# EAGLE design Arduino Micro RGB Controller (EAGLE 8.6.0)
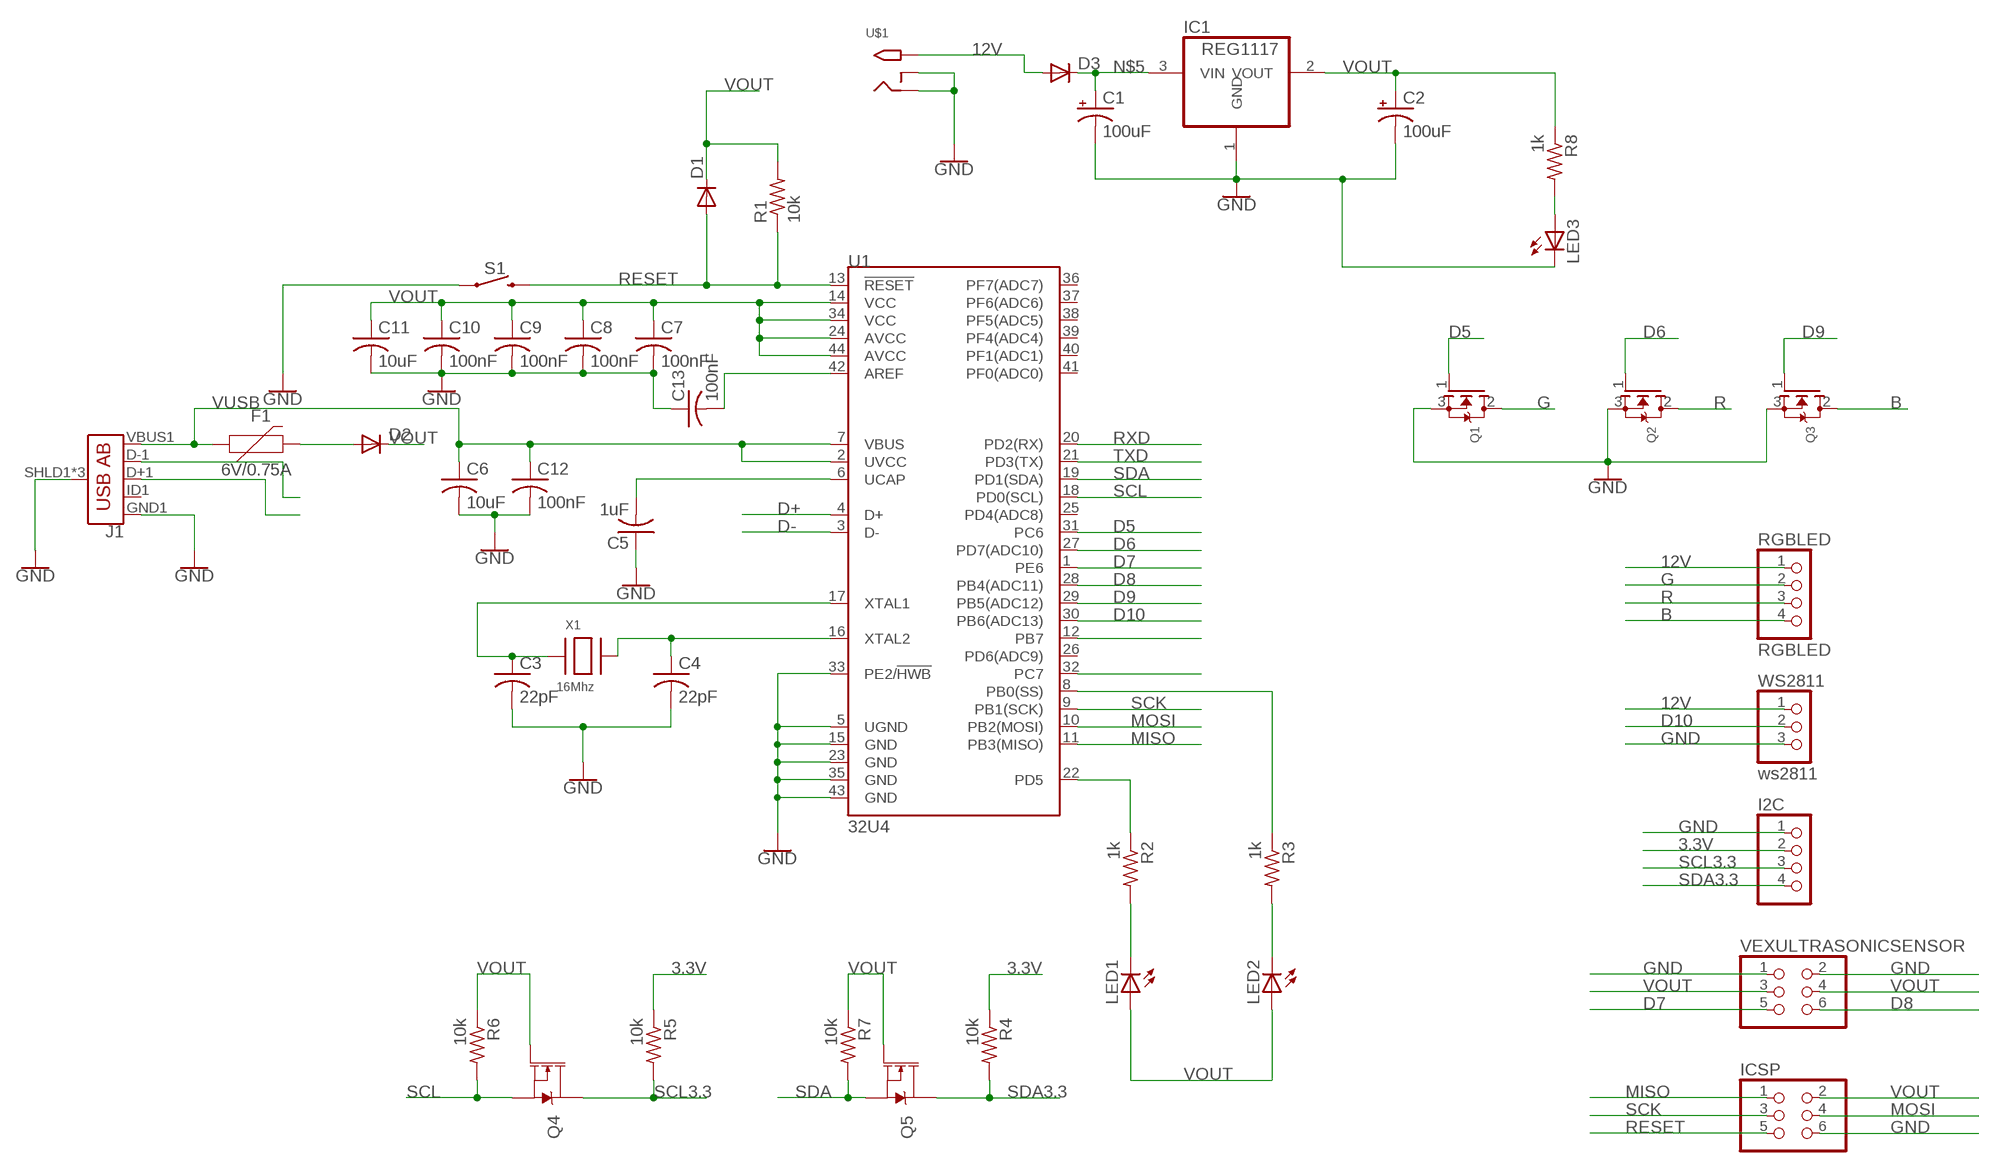
[diagram p0: schematic, sheet 1]

## Parts
C1  100uF  CPOL-USCT7343  [CT7343]
C2  100uF  CPOL-USCT7343  [CT7343]
C3  22pF  C-USC0805  [C0805]
C4  22pF  C-USC0805  [C0805]
C5  1uF  C-USC0805  [C0805]
C6  10uF  C-USC0805  [C0805]
C7  100nF  C-USC0805  [C0805]
C8  100nF  C-USC0805  [C0805]
C9  100nF  C-USC0805  [C0805]
C10  100nF  C-USC0805  [C0805]
C11  10uF  C-USC0805  [C0805]
C12  100nF  C-USC0805  [C0805]
C13  100nF  C-USC0805  [C0805]
D1  DIODE-SOD123  [SOD123]
D2  DIODE-SOD123  [SOD123]
D3  DIODE-SOD123  [SOD123]
F1  6V/0.75A  PPTC_THREE-QUARTER-AMP  [1206]
I2C  PINHD-1X4  [1X04]
IC1  REG1117  [SOT223]
ICSP  PINHD-2X3  [2X03]
J1  USB_AB_SMT  [USB-AB-MICRO-SMD]
LED1  LEDCHIPLED_0603  [CHIPLED_0603]
LED2  LEDCHIPLED_0603  [CHIPLED_0603]
LED3  LEDCHIPLED_0603  [CHIPLED_0603]
Q1  MOSFET-NGDS_TO220V  [TO220V]
Q2  MOSFET-NGDS_TO220V  [TO220V]
Q3  MOSFET-NGDS_TO220V  [TO220V]
Q4  220mA/50V/3.5Ω  MOSFET-NCH-BSS138  [SOT23-3]
Q5  220mA/50V/3.5Ω  MOSFET-NCH-BSS138  [SOT23-3]
R1  10k  R-US_M0805  [M0805]
R2  1k  R-US_M0805  [M0805]
R3  1k  R-US_M0805  [M0805]
R4  10k  R-US_M0805  [M0805]
R5  10k  R-US_M0805  [M0805]
R6  10k  R-US_M0805  [M0805]
R7  10k  R-US_M0805  [M0805]
R8  1k  R-US_M0805  [M0805]
RGBLED  RGBLED  PINHD-1X4  [1X04]
S1  MOMENTARY-SWITCH-SPST-SMD-6.0X3.5MM  [TACTILE_SWITCH_SMD_6.0X3.5MM]
U1  32U4  ATMEGA32U4TQFP-44  [TQFP44]
U$1  2.1MMJACKTHM  [PJ-102A]
VEXULTRASONICSENSOR  PINHD-2X3  [2X03]
WS2811  ws2811  PINHD-1X3  [1X03]
X1  16Mhz  XTALNX5032  [NX5032]

## Nets
3.3V: I2C.2 R4.1 R5.1
12V: D3.A RGBLED.1 U$1.TIP WS2811.1
B: Q3.2(D) RGBLED.4
D5: Q1.1(G) U1.31(PC6)
D6: Q2.1(G) U1.27(PD7(ADC10))
D7: U1.1(PE6) VEXULTRASONICSENSOR.5
D8: U1.28(PB4(ADC11)) VEXULTRASONICSENSOR.6
D9: Q3.1(G) U1.29(PB5(ADC12))
D10: U1.30(PB6(ADC13)) WS2811.2
D+: J1.D+1(D+) U1.4(D+)
D-: J1.D-1(D-) U1.3(D-)
G: Q1.2(D) RGBLED.2
GND: C1.- C2.- C3.2 C4.2 C5.1 C6.2 C7.2 C8.2 C9.2 C10.2 C11.2 C12.2 C13.1 I2C.1 IC1.1(GND) ICSP.6 J1.GND1(GND) J1.SHLD1(SHIELD) J1.SHLD2(SHIELD) J1.SHLD3(SHIELD) LED3.C Q1.3(S) Q2.3(S) Q3.3(S) S1.1 U1.5(UGND) U1.15(GND) U1.23(GND) U1.33(PE2/!HWB) U1.35(GND) U1.43(GND) U$1.RING U$1.RING_SW VEXULTRASONICSENSOR.1 VEXULTRASONICSENSOR.2 WS2811.3
MISO: ICSP.1 U1.11(PB3(MISO))
MOSI: ICSP.4 U1.10(PB2(MOSI))
N$1: LED1.C R2.2
N$2: LED3.A R8.2
N$3: R3.1 U1.8(PB0(SS))
N$4: C5.2 U1.6(UCAP)
N$5: C1.+ D3.C IC1.3(VIN)
N$6: LED2.C R3.2
N$7: C3.1 U1.17(XTAL1) X1.P$1
N$8: C4.1 U1.16(XTAL2) X1.P$2
N$9: C13.2 U1.42(AREF)
N$10: R2.1 U1.22(PD5)
N$11: D2.A F1.2
N$15: U1.12(PB7)
N$16: U1.32(PC7)
R: Q2.2(D) RGBLED.3
RESET: D1.A ICSP.5 R1.1 S1.2 U1.13(!RESET)
RXD: U1.20(PD2(RX))
SCK: ICSP.3 U1.9(PB1(SCK))
SCL: Q4.2(S) R6.2 U1.18(PD0(SCL))
SCL3.3: I2C.3 Q4.3(D) R5.2
SDA: Q5.2(S) R7.2 U1.19(PD1(SDA))
SDA3.3: I2C.4 Q5.3(D) R4.2
TXD: U1.21(PD3(TX))
VOUT: C2.+ C7.1 C8.1 C9.1 C10.1 C11.1 D1.C D2.C IC1.2(VOUT) ICSP.2 LED1.A LED2.A Q4.1(G) Q5.1(G) R1.2 R6.1 R7.1 R8.1 U1.14(VCC) U1.24(AVCC) U1.34(VCC) U1.44(AVCC) VEXULTRASONICSENSOR.3 VEXULTRASONICSENSOR.4
VUSB: C6.1 C12.1 F1.1 J1.VBUS1(VBUS) U1.2(UVCC) U1.7(VBUS)
Unconnected: J1.ID1(USBID) U1.25(PD4(ADC8)) U1.26(PD6(ADC9)) U1.36(PF7(ADC7)) U1.37(PF6(ADC6)) U1.38(PF5(ADC5)) U1.39(PF4(ADC4)) U1.40(PF1(ADC1)) U1.41(PF0(ADC0))

## Library data of the parts
C1 C2 = adafruit:CPOL-US: POLARIZED CAPACITOR, American symbol
C3-C13 = adafruit:C-US: CAPACITOR, American symbol
D1-D3 = diode:DIODE-: DIODE
F1 = SparkFun-Fuses:PPTC: Resettable Fuse PPTC Resettable Fuse. Really a sort of resistor with a polymeric positive temperature coefficient whose resistance increases dramatically with an increase in temperature. When heated by the power passing through the resistance rises causing the current to be limited, protecting the circuit. This is achieved by the transition of the polymer from a crystalline to an amorphous state where the conductive carbon separates breaking the conductive pathways found in the cool crystalline structure. When a PPTC cools back down it resumes conducting letting the circuit turn back on. SparkFun Products: SparkFun RedBoard - Programmed with Arduino <https://www.sparkfun.com/products/12757> Pro Micro - 5V/16MHz <https://www.sparkfun.com/products/12640> Arduino Pro 328 - 5V/16MHz <https://www.sparkfun.com/products/10915> MP3 Trigger <https://www.sparkfun.com/products/13720>; PROD_ID: RES-11150
I2C RGBLED = pinhead:PINHD-1X4: PIN HEADER
IC1 = burr-brown:REG1117: 800mA and 1A Low Dropout (LDO) Positive Regulator 1.8V, 2.5V, 2.85V, 3.3V, 5V, and Adj; MPN: REG1117; OC_FARNELL: 1097566; OC_NEWARK: 14P6981
ICSP VEXULTRASONICSENSOR = pinhead:PINHD-2X3: PIN HEADER
J1 = SparkFun-Connectors:USB_AB: USB Type AB Micro Connector OTG-compatible. 5 pins, 3 shield pins SparkFun Products: IOIO-OTG <https://www.sparkfun.com/products/13613> SparkFun SAMD21 Mini Breakout <https://www.sparkfun.com/products/13664>; PROD_ID: CONN-11794
LED1-LED3 = adafruit:LED: LED OSRAM: - CHIPLED LG R971, LG N971, LY N971, LG Q971, LY Q971, LO R971, LY R971 LH N974, LH R974 LS Q976, LO Q976, LY Q976 LO Q996 - Hyper CHIPLED LW Q18S LB Q993, LB Q99A, LB R99A - SideLED LS A670, LO A670, LY A670, LG A670, LP A670 LB A673, LV A673, LT A673, LW A673 LH A674 LY A675 LS A676, LA A676, LO A676, LY A676, LW A676 LS A679, LY A679, LG A679 - Hyper Micro SIDELED® LS Y876, LA Y876, LO Y876, LY Y876 LT Y87S - SmartLED LW L88C, LW L88S LB L89C, LB L89S, LG L890 LS L89K, LO L89K, LY L89K LS L896, LA L896, LO L896, LY L896 - TOPLED LS T670, LO T670, LY T670, LG T670, LP T670 LSG T670, LSP T670, LSY T670, LOP T670, LYG T670 LG T671, LOG T671, LSG T671 LB T673, LV T673, LT T673, LW T673 LH T674 LS T676, LA T676, LO T676, LY T676, LB T676, LH T676, LSB T676, LW T676 LB T67C, LV T67C, LT T67C, LS T67K, LO T67K, LY T67K, LW E67C LS E67B, LA E67B, LO E67B, LY E67B, LB E67C, LV E67C, LT E67C LW T67C LS T679, LY T679, LG T679 LS T770, LO T770, LY T770, LG T770, LP T770 LB T773, LV T773, LT T773, LW T773 LH T774 LS E675, LA E675, LY E675, LS T675 LS T776, LA T776, LO T776, LY T776, LB T776 LHGB T686 LT T68C, LB T68C - Hyper Mini TOPLED® LB M676 - Mini TOPLED Santana® LG M470 LS M47K, LO M47K, LY M47K Source: http://www.osram.convergy.de/
Q1-Q3 = adafruit:MOSFET-N: N-Channel Mosfet 2N7002E - 60V 260mA SOT23 [Digikey: 2N7002ET1GOSTR-ND] - REEL BSH103 - 30V 850mA SOT23 [Digikey: 568-5013-1-ND]
Q4 Q5 = SparkFun-DiscreteSemi:MOSFET-NCH: N-channel MOSFETs Voltage controlled devices that allow control of high current outputs. SparkFun Products: SparkFun OpenScale <https://www.sparkfun.com/products/13261> SparkFun Digital Sandbox <https://www.sparkfun.com/products/12651> SparkFun Monster Moto Shield <https://www.sparkfun.com/products/10182> SparkFun MOSFET Power Controller <https://www.sparkfun.com/products/11214>; PROD_ID: TRANS-00830
R1-R8 = adafruit:R-US_: RESISTOR, American symbol
S1 = SparkFun-Switches:MOMENTARY-SWITCH-SPST: Momentary Switch (Pushbutton) - SPST Normally-open (NO) SPST momentary switches (buttons, pushbuttons). Variants PTH-12MM - 12mm square, through-hole Momentary Pushbutton Switch - 12mm Square <https://www.sparkfun.com/products/9190> (COM-09190) PTH-6.0MM, PTH-6.0MM-KIT - 6.0mm square, through-hole Mini Pushbutton Switch <https://www.sparkfun.com/products/97> (COM-00097) KIT package intended for soldering kit's - only one side of pads' copper is exposed. PTH-RIGHT-ANGLE-KIT - Right-angle, through-hole Right Angle Tactile Button <https://www.sparkfun.com/products/10791> - Used on SparkFun BigTime Watch Kit <https://www.sparkfun.com/products/11734> SMD-12MM - 12mm square, surface-mount Tactile Button - SMD (12mm) <https://www.sparkfun.com/products/12993> (COM-12993) Used on SparkFun PicoBoard <https://www.sparkfun.com/products/11888> SMD-4.5MM - 4.5mm Square Trackball Switch Used on SparkFun Blackberry Trackballer Breakout <https://www.sparkfun.com/products/13169> SMD-4.6MMX2.8MM - 4.60mm x 2.80mm, surface mount Used on SparkFun SAMD21 Mini Breakout <https://www.sparkfun.com/products/13664> SMD-5.2MM, SMD-5.2-REDUNDANT - 5.2mm square, surface-mount Mini Pushbutton Switch - SMD <https://www.sparkfun.com/products/8720> (COM-08720) Used on Arduino Pro Mini <https://www.sparkfun.com/products/11114> REDUNDANT package connects both switch circuits together SMD-6.0X3.5MM - 6.0 x 3.5mm, surface mount Momentary Reset Switch SMD <https://www.sparkfun.com/products/8229> (COM-08229) SMD-6.2MM-TALL - 6.2mm square, surface mount Tactile Button - SMD (6mm) <https://www.sparkfun.com/products/12992> Used on SparkFun Digital Sandbox <https://www.sparkfun.com/products/12651> SMD-RIGHT-ANGLE - Right-angle, surface mount Used on SparkFun Block for Intel® Edison - Arduino <https://www.sparkfun.com/products/13036>; PROD_ID: SWCH-00815; SF_SKU: COM-08229
U1 = SparkFun-IC-Microcontroller:ATMEGA32U4: Atmel MCU, 32KByte Atmel 44-pin 8-bit Microcontroller with 32KBytes of ISP Flash and USB Controller Datasheet <http://cdn.sparkfun.com/datasheets/Dev/Arduino/Boards/ATMega32U4.pdf> SparkFun Products LilyPad Arduino USB - ATmega32U4 Board <https://www.sparkfun.com/products/12049> (DEV-12049) Pro Micro - 5V/16MHz <https://www.sparkfun.com/products/12640> (DEV-12640) Pro Micro - 3.3V/8MHz <https://www.sparkfun.com/products/12587> (DEV-12587) Fio v3 - ATmega32U4 <https://www.sparkfun.com/products/11520> (DEV-11520) Qduino Mini <https://www.sparkfun.com/products/13614> (DEV-13614) Makey Makey - Standard Kit <https://www.sparkfun.com/products/11511> (WIG-11511) Makey Makey Deluxe Kit <https://www.sparkfun.com/products/11519> (WIG-11519); PROD_ID: IC-11161
U$1 = adafruit:2.1MMJACK: 2.1mm x 5.5mm THM DC jack with internal switch. Digikey part #PJ-102A, 4UCON part #05537 2.1mm x 5.5mm SMT DC jack with internal switch. Digikey part #PJ-002A-SMT, 4UCON part #03267 By microbuilder.eu & adafruit.com
WS2811 = pinhead:PINHD-1X3: PIN HEADER
X1 = adafruit:XTAL: Low cost SMT crystals, no capacitors included http://www.ladyada.net/library/eagle

## Board
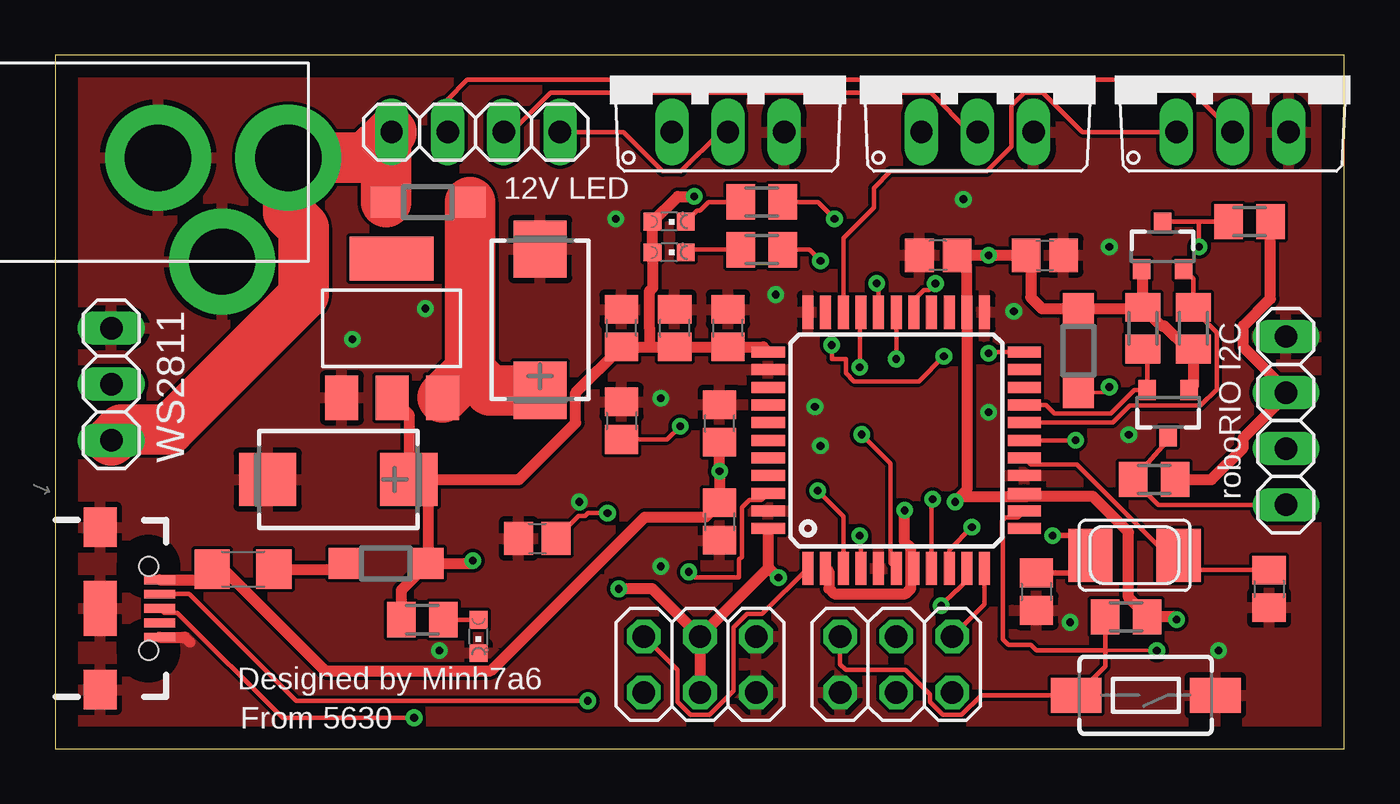
[diagram p1: board, top side]
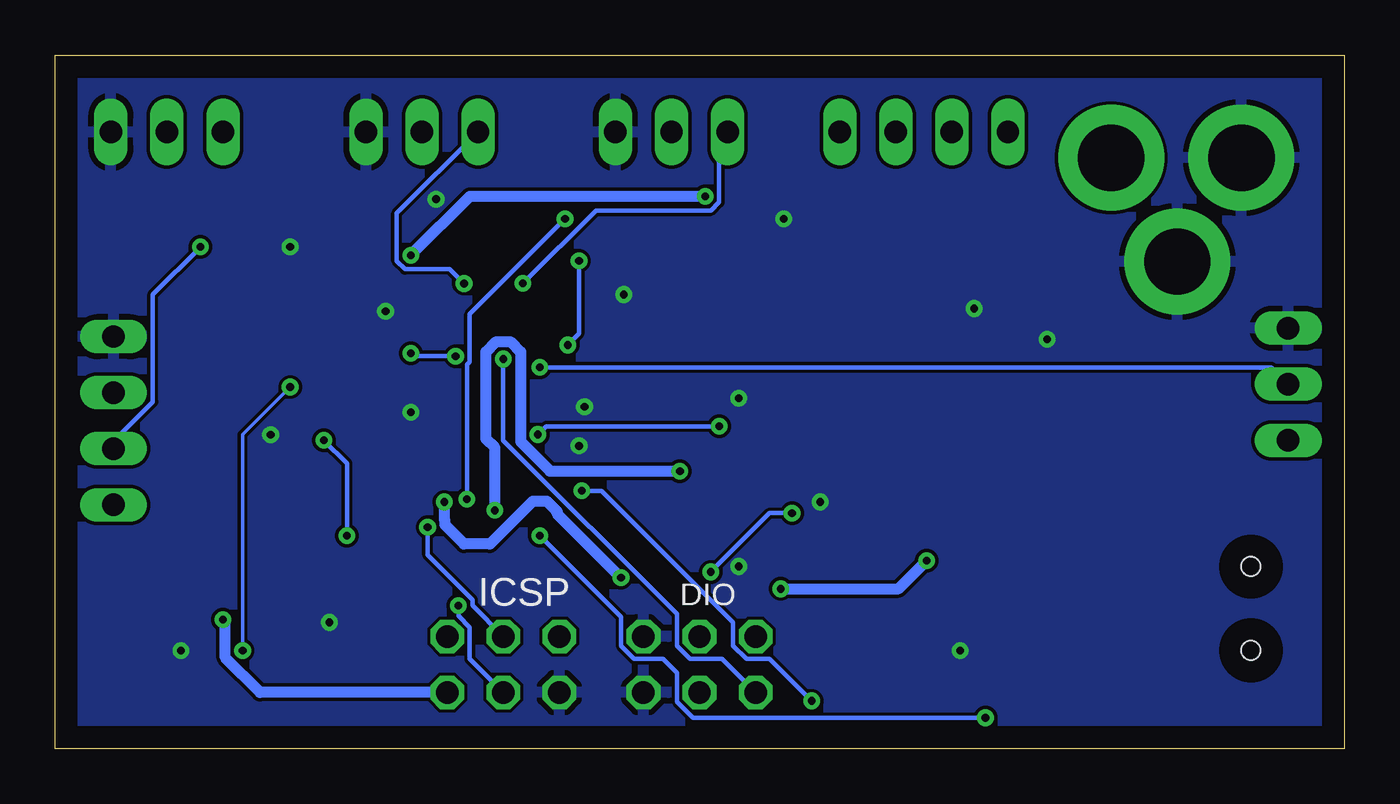
[diagram p2: board, bottom side, seen from below]

Size 58.4 x 31.42 mm. Coordinates in mm from the lower left corner, seen from the top.
Outline: 0,0 58.4,0 58.4,31.42 0,31.42 0,0
Copper layers (1*16): Top 0.035mm / dielectric 1.5mm / Bottom 0.035mm
Design rules "default": minimum track width 6mil, minimum drill 0.35mm, track to track 6mil, track to pad 6mil, pad to pad 6mil, via to via 6mil, smd to smd 6mil, copper to edge 40mil, drill to drill 6mil, minimum pad ring 10mil, minimum via ring 8mil, stop-mask expansion 4mil, vias tented up to drill 0mil, thermal gap 10mil

### Footprints (pad centres in the part's own frame; a part is rotated, then mirrored left to right if it is on the bottom)
CT7343 = smd 2.6 x 2.4: + 3.2,0; - -3.2,0
C0805 = smd 1.3 x 1.5: 1 -0.85,0; 2 0.85,0
SOD123 = smd 1.4 x 1.4: A 1.9,0; C -1.9,0
1206 = smd 1.6 x 1.8: 1 -1.4,0; 2 1.4,0
1X04 = drill 1.016 long: 1 -3.81,0; 2 -1.27,0; 3 1.27,0; 4 3.81,0
SOT223 = smd 1.499 x 2.007: 1 -2.261,-3.15; 2 0.025,-3.15; 3 2.311,-3.15 | smd 3.81 x 2.007: 4 0,3.15
2X03 = drill 1.016 octagon: 1 -2.54,-1.27; 2 -2.54,1.27; 3 0,-1.27; 4 0,1.27; 5 2.54,-1.27; 6 2.54,1.27
USB-AB-MICRO-SMD = smd 1.4 x 0.4: D+1 2.7,0; D-1 2.7,0.65; GND1 2.7,-1.3; ID1 2.7,-0.65; VBUS1 2.7,1.3 | smd 1.5 x 1.8: SHLD1 0,-3.68; SHLD2 0,3.68 | smd 1.5 x 2.5: SHLD3 0,0 | hole 0.85: 2.2,1.9; 2.2,-1.9
CHIPLED_0603 = smd 0.8 x 0.8: A 0,-0.75; C 0,0.75
TO220V = drill 1.016 long: 1 -2.54,-2.54; 2 0,-2.54; 3 2.54,-2.54
SOT23-3 = smd 0.8 x 0.9: 1 -0.95,-1; 2 0.95,-1; 3 0,1.1
M0805 = smd 1.3 x 1.6: 1 -0.95,0; 2 0.95,0
TACTILE_SWITCH_SMD_6.0X3.5MM = smd 2.3 x 1.6: 1 -3.15,0; 2 3.15,0
TQFP44 = smd 1.5 x 0.5: 1 -5.8,4; 2 -5.8,3.2; 3 -5.8,2.4; 4 -5.8,1.6; 5 -5.8,0.8; 6 -5.8,0; 7 -5.8,-0.8; 8 -5.8,-1.6; 9 -5.8,-2.4; 10 -5.8,-3.2; 11 -5.8,-4; 23 5.8,-4; 24 5.8,-3.2; 25 5.8,-2.4; 26 5.8,-1.6; 27 5.8,-0.8; 28 5.8,0; 29 5.8,0.8; 30 5.8,1.6; 31 5.8,2.4; 32 5.8,3.2; 33 5.8,4 | smd 0.5 x 1.5: 12 -4,-5.8; 13 -3.2,-5.8; 14 -2.4,-5.8; 15 -1.6,-5.8; 16 -0.8,-5.8; 17 0,-5.8; 18 0.8,-5.8; 19 1.6,-5.8; 20 2.4,-5.8; 21 3.2,-5.8; 22 4,-5.8; 34 4,5.8; 35 3.2,5.8; 36 2.4,5.8; 37 1.6,5.8; 38 0.8,5.8; 39 0,5.8; 40 -0.8,5.8; 41 -1.6,5.8; 42 -2.4,5.8; 43 -3.2,5.8; 44 -4,5.8
PJ-102A = drill 3 pad 4.8: RING 0.1,-3.39; RING_SW -4.6,-6.29; TIP 0.1,-9.29
1X03 = drill 1.016 long: 1 -2.54,0; 2 0,0; 3 2.54,0
NX5032 = smd 2 x 2.4: P$1 2,0; P$2 -2,0

### Placement (x,y rotation side)
C1  21.97,19.43 270 top
C2  12.83,12.19 0 top
C3  44.45,7.11 270 top
C4  54.99,7.24 270 top
C5  25.65,14.86 270 top
C6  30.1,10.29 270 top
C7  30.48,19.05 90 top
C8  44.83,22.35 0 top
C9  28.07,19.05 90 top
C10  40.01,22.35 180 top
C11  25.65,19.05 90 top
C12  30.1,14.73 90 top
C13  21.84,9.53 0 top
D1  46.35,18.03 270 top
D2  14.99,8.38 180 top
D3  16.89,24.77 180 top
F1  8.51,8.13 0 top
I2C  55.75,14.86 270 top
IC1  15.24,19.05 0 top
ICSP  38.1,3.81 180 top
J1  2.03,6.35 0 top
LED1  27.81,22.48 270 top
LED2  27.81,23.88 270 top
LED3  19.18,5.08 180 top
Q1  53.34,30.48 0 top
Q2  41.78,30.48 0 top
Q3  30.48,30.48 0 top
Q4  50.16,22.73 0 top
Q5  50.42,15.24 180 top
R1  48.51,5.97 0 top
R2  32,22.61 180 top
R3  32,24.77 180 top
R4  49.78,12.19 180 top
R5  54.1,23.88 180 top
R6  51.56,19.05 90 top
R7  49.28,19.05 270 top
R8  16.64,5.84 0 top
RGBLED  19.05,27.94 0 top
S1  49.4,2.41 180 top
U1  38.1,13.97 90 top
U$1  1.27,26.67 90 top
VEXULTRASONICSENSOR  29.21,3.81 180 top
WS2811  2.54,16.51 90 top
X1  48.9,8.76 180 top

### Tracks (layer width: path | path; a pad name or v marks a point on that pad's centre or on a via)
3.3V
  Top 0.508: R5.1 55.05,20.38 53.82,19.15 53.82,18.18 55.75,16.25 I2C.2 55.75,16 53.82,14.07 53.82,13.63 52.38,12.19 R4.1
12V
  Top 2.286: WS2811.1 3.02,14.45 5.17,14.45 11.26,20.54 11.26,23.6 10.56,24.3 U$1.TIP 14.07,26.77 RGBLED.1 14.99,27.69 D3.A
B
  Top 0.203: Q3.2 30.14,27.94 28.36,26.16 27.52,26.16 25.74,27.94 RGBLED.4
D5
  Top 0.203: U1.31 35.7,23.13 37.08,24.51 37.08,25.4 37.85,26.16 42.2,26.16 43.31,27.27 43.31,29.12 43.9,29.72 44.74,29.72 46.52,27.94 Q1.1
D6  (via drill 0.35)
  Top 0.203: v39.88,21.07 39.58,20.77 39.34,20.77 38.9,20.33 U1.27
  Bottom 0.203: v39.88,21.07 40.53,21.72 42.55,21.72 42.92,22.09 42.92,24.26 Q2.1
D7
  Top 0.203: U1.1 32.03,6.1 31.33,6.1 30.73,5.5 30.73,2.63 29.63,1.52 28.79,1.52 28.19,2.12 28.19,3.56 VEXULTRASONICSENSOR.5
D8  (via drill 0.35)
  Top 0.203: U1.28 v38.1,17.65
  Bottom 0.203: v38.1,17.65 38.1,13.97 30.23,6.1 30.23,4.66 29.63,4.06 28.19,4.06 VEXULTRASONICSENSOR.6
D9  (via drill 0.35)
  Top 0.203: v37.21,21.08 37.3,20.99 U1.29
  Bottom 0.203: Q3.1 28.32,27.56 28.32,24.77 28.32,24.76 28.69,24.39 33.91,24.39 v37.21,21.08
D10  (via drill 0.35)
  Top 0.203: v36.45,17.27 36.45,19.72 U1.30
  Bottom 0.203: WS2811.2 3.3,17.27 v36.45,17.27
D+  (via drill 0.35)
  Top 0.203: U1.4 36.5,9.6 v36.45,9.65 | J1.D+1 4.93,6.15 5.54,6.15 10.29,1.4 v16.26,1.4
  Bottom 0.203: v36.45,9.65 32.77,5.97 32.77,4.66 32.17,4.06 30.86,4.06 30.23,3.43 30.23,2.12 29.5,1.4 v16.26,1.4
D-  (via drill 0.35)
  Top 0.203: v34.54,11.68 35.7,10.53 U1.3 | J1.D-1 6.08,7 10.92,2.16 v24.13,2.16
  Bottom 0.203: v34.54,11.68 33.66,11.68 27.69,5.71 27.69,4.66 27.09,4.06 26.04,4.06 v24.13,2.16
G
  Top 0.203: Q1.2 50.98,30.3 18.67,30.3 17.78,29.41 RGBLED.2
GND  (via drill 0.35)
  Top 0.508: J1.GND1 5.87,5.05 6.1,4.83
  other vias: 42.29,15.24 45.97,5.71 47.75,22.73 34.42,15.49 17.4,4.45 43.43,19.81 41.15,24.89 32.64,20.57 25.4,24 52.7,4.45 23.75,11.18 27.43,8.26 27.43,15.88 13.46,18.54 16.76,19.94 48.64,14.22 34.67,13.72
  pour Top: -1.78,1.91 -1.78,32.89 -1.65,33.02 59.56,33.02 59.56,-1.4 59.69,-1.52 1.52,-1.52 -1.78,1.78
  pour Bottom: -3.56,-1.91 -3.56,34.92 -3.43,35.05 60.96,35.05 61.09,34.92 61.09,-2.41 60.96,-2.54 -3.3,-2.54 -3.43,-2.41 -3.56,-2.29 -3.56,-2.03
MISO
  Top 0.203: ICSP.1 42.1,6.54 U1.11
MOSI  (via drill 0.35)
  Top 0.203: v40.13,6.48 40.82,7.17 40.85,7.17 41.3,7.61 U1.10
  Bottom 0.203: v40.13,6.48 40.13,6.01 39.62,5.5 39.62,4.06 ICSP.4
N$1
  Top 0.203: LED1.C 28.69,22.61 R2.2
N$2
  Top 0.203: R8.2 19.16,5.84 LED3.A
N$3  (via drill 0.35)
  Top 0.203: U1.8 39.7,11.25 v39.75,11.3 | v35.31,24 34.54,24.77 R3.1
  Bottom 0.203: v39.75,11.3 39.75,17.39 39.63,17.52 39.63,19.68 v35.31,24
N$4  (via drill 0.35)
  Top 0.203: C5.2 27.73,14.01 v28.32,14.61 | v36.53,14.23 37.85,12.91 37.85,8.42 U1.6
  Bottom 0.203: v28.32,14.61 36.16,14.61 v36.53,14.23
N$5
  Top 2.286: D3.C 18.79,17.14 | 18.79,17.14 IC1.3 | C1.+ 19.7,16.23 18.79,17.14
N$6
  Top 0.203: LED2.C 29.07,24.39 29.22,24.39 29.6,24.77 R3.2
N$7  (via drill 0.35)
  Top 0.203: C3.1 45.71,7.96 | 45.88,9.65 v45.18,9.65 | v46.23,13.97 U1.17
  Top 0.254: v45.18,9.65 46.01,9.65 X1.P$1 46.9,8.41 46.35,7.87 46.27,7.96 C3.1
  Bottom 0.203: v45.18,9.65 45.18,12.92 v46.23,13.97
N$8
  Top 0.203: C4.1 51.44,8.09 X1.P$2 50.26,8.89 46.28,12.87 44.2,12.87 U1.16
N$9  (via drill 0.35)
  Top 0.203: U1.42 32,11.27 31.45,11.27 31.1,10.93 31.1,8.68 30.99,8.57 30.99,7.75 28.96,7.75 v28.7,8 | v25.02,10.67 24.14,10.67 24.01,10.54 23.71,10.54 C13.2
  Bottom 0.203: v28.7,8 26.04,10.67 v25.02,10.67
N$10  (via drill 0.35)
  Top 0.152: v42.29,17.91 42.35,17.97
  Top 0.203: 42.35,17.97 U1.22 | R2.1 34.16,22.61 v34.67,22.1 | v35.18,18.29 35.18,17.65 35.82,17.65 35.82,17.01 36.19,16.64 39.12,16.64 v40.26,17.78
  Bottom 0.203: v40.26,17.78 42.16,17.78 v42.29,17.91 | v34.67,22.1 34.67,18.8 v35.18,18.29
N$11
  Top 0.508: F1.2 12.83,8.13 D2.A
R
  Top 0.203: RGBLED.3 20.66,27.94 22.44,29.72 39.66,29.72 41.44,27.94 Q2.2
RESET  (via drill 0.35)
  Top 0.152: 47.56,4.32 47.69,4.45 v49.91,4.45 | v47.75,16.38 47.5,16.13 D1.A
  Top 0.203: 47.56,4.45 47.56,4.32 47.56,3.72 S1.2 41.95,2.41 41.06,1.52 40.22,1.52 39.62,2.12 39.62,2.45 38.52,3.56 35.81,3.56 35.56,3.81 ICSP.5 | 47.56,4.45 R1.1 | U1.13 43.6,10.47 43.05,10.47 42.9,10.32 42.9,9.62 42.93,9.59 42.93,4.95 43.18,4.7 44.2,4.7 44.45,4.45 47.56,4.45
  Bottom 0.152: v49.91,4.45 49.91,14.22 v47.75,16.38
SCK  (via drill 0.35)
  Top 0.203: v41.53,10.03 40.5,9 U1.9
  Bottom 0.203: ICSP.3 39.5,6.48 39.5,6.74 41.53,8.77 v41.53,10.03
SCL
  Top 0.203: U1.18 47.91,14.77 48.68,15.54 51.87,15.54 52.62,16.28 52.62,18.86 51.56,19.91 R6.2 51.56,21.29 Q4.2
SCL3.3  (via drill 0.35)
  Top 0.203: R5.2 51.82,23.88 | 51.82,23.88 50.21,23.88 Q4.3 | v51.82,22.73 51.82,23.88
  Bottom 0.203: I2C.3 55.75,13.93 53.98,15.71 53.98,20.57 v51.82,22.73
SDA
  Top 0.203: R7.2 49.47,17.91 Q5.2 48.88,16.24 47.82,15.18 45.27,15.18 44.88,15.57 U1.19
SDA3.3
  Top 0.203: Q5.3 50.48,14.07 R4.2 49.98,11.05 I2C.4
VOUT  (via drill 0.35)
  Top 0.508: U1.34 32.07,18.2 C7.1 C9.1 26.92,18.2 | R7.1 49.21,19.93 D1.C 44.71,19.93 44.2,20.45 44.2,22.14 C8.1 v42.29,22.35 C10.1 41.3,21.91 U1.24 41.3,11.71 v40.77,11.18 41.02,11.43 44.04,11.43 | R7.1 49.28,21.67 Q4.1 | Q5.1 51.56,16.43 R6.1 51.3,18.1 50.24,19.16 50.12,19.16 R7.1 | 44.04,11.43 U1.14 | 44.04,11.43 47.01,11.43 48.62,9.81 48.62,6.85 49.46,6.01 R1.2 50.67,5.97 v50.8,5.84 | 26.92,18.2 C11.1 23.58,16.12 23.58,14.76 21.01,12.19 C2.+ | 26.92,18.2 26.92,19.07 26.91,19.08 26.91,20.72 27.06,20.87 LED1.A LED2.A 28.21,25.02 v28.96,25.02 | VEXULTRASONICSENSOR.3 VEXULTRASONICSENSOR.4 | 15.49,6.04 R8.1 15.69,7.18 D2.C | U1.44 32.3,8.21 | 32.3,8.21 v32.77,7.74 | VEXULTRASONICSENSOR.3 32.3,8.17 32.3,8.21 | VEXULTRASONICSENSOR.3 27.05,7.24 v25.53,7.24 | D2.C 18.8,8.38 v18.92,8.51 | IC1.2 16.03,15.14 C2.+ | C2.+ 16.89,11.33 D2.C
  Bottom 0.508: v28.96,25.02 39.62,25.02 v42.29,22.35 | v50.8,5.84 50.7,5.74 50.7,4.12 49.12,2.54 ICSP.2 | v32.77,7.74 35.66,10.64 35.66,10.74 36.12,11.2 36.77,11.2 38.7,9.27 39.88,9.27 40.74,10.14 40.74,10.36 40.77,10.38 v40.77,11.18 | v25.53,7.24 20.19,7.24 v18.92,8.51
VUSB  (via drill 0.35)
  Top 0.508: J1.VBUS1 6.38,7.65 F1.1 7.63,8.13 12.24,3.52 19.75,3.52 26.71,10.49 29.45,10.49 C6.1 v30.1,12.57 C12.1 | 38.76,8.03 38.76,7.25 38.52,7.01 35.28,7.01 35.04,7.25 35.04,8.03 U1.2 | 38.76,8.03 U1.7 | 38.76,8.03 38.76,9.09 38.48,9.36 v38.48,10.79
  Bottom 0.508: v30.1,12.57 35.98,12.57 37.31,13.9 37.31,17.98 37.77,18.44 38.42,18.44 38.88,17.98 38.88,14.04 38.48,13.63 v38.48,10.79

### Text on the board
tPlace: 12V LED | WS2811 | roboRIO I2C | Designed by Minh7a6 | From 5630
bPlace: DIO | ICSP